# EAGLE schematic EE120PersonalProjectSchematic (EAGLE 7.3.0)
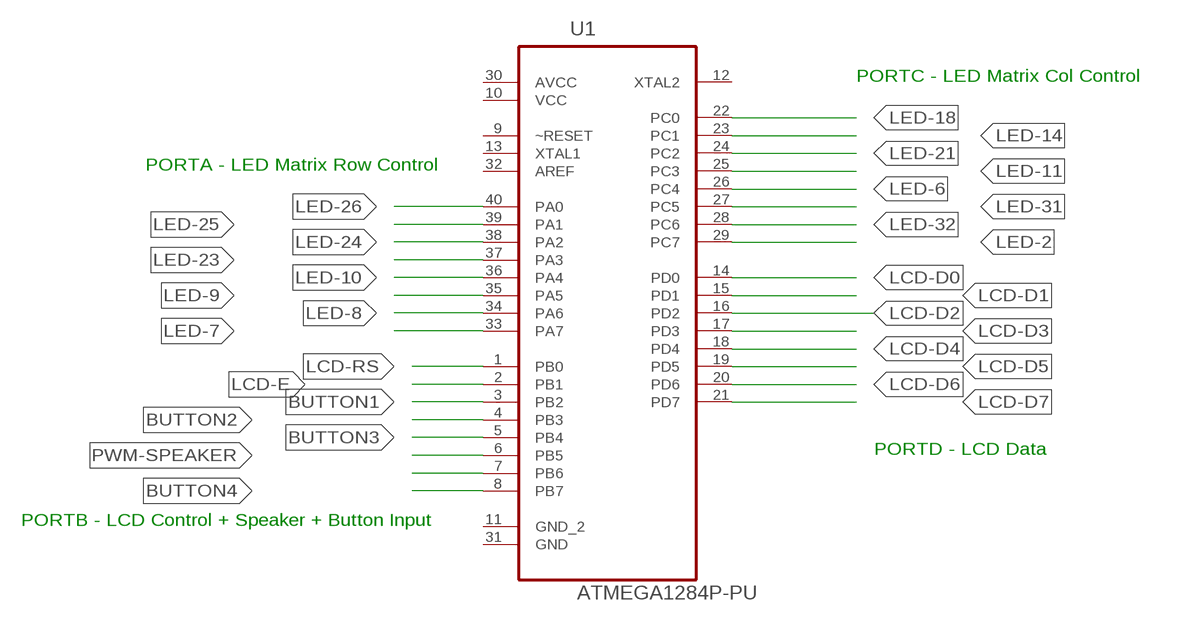
[diagram p0: schematic, sheet 1]

## Parts
U1  ATMEGA1284P-PU  [DIP254P1524X483-40]

## Nets
BUTTON1: U1.3(PB2)
BUTTON2: U1.4(PB3)
BUTTON3: U1.5(PB4)
BUTTON4: U1.8(PB7)
LCD-D0: U1.14(PD0)
LCD-D1: U1.15(PD1)
LCD-D2: U1.16(PD2)
LCD-D3: U1.17(PD3)
LCD-D4: U1.18(PD4)
LCD-D5: U1.19(PD5)
LCD-D6: U1.20(PD6)
LCD-D7: U1.21(PD7)
LCD-E: U1.2(PB1)
LCD-RS: U1.1(PB0)
LED-2: U1.29(PC7)
LED-6: U1.26(PC4)
LED-7: U1.33(PA7)
LED-8: U1.34(PA6)
LED-9: U1.35(PA5)
LED-10: U1.36(PA4)
LED-11: U1.25(PC3)
LED-14: U1.23(PC1)
LED-18: U1.22(PC0)
LED-21: U1.24(PC2)
LED-23: U1.37(PA3)
LED-24: U1.38(PA2)
LED-25: U1.39(PA1)
LED-26: U1.40(PA0)
LED-31: U1.27(PC5)
LED-32: U1.28(PC6)
N$9: U1.7(PB6)
PWM-SPEAKER: U1.6(PB5)
Unconnected: U1.9(~RESET) U1.11(GND_2) U1.12(XTAL2) U1.13(XTAL1) U1.31(GND) U1.32(AREF)

## Notes on the sheet
- PORTC - LED Matrix Col Control
- PORTA - LED Matrix Row Control
- PORTD - LCD Data
- PORTB - LCD Control + Speaker + Button Input

## Power pins joined to a net without a drawn wire
AVCC: U1.30(AVCC)
VCC: U1.10(VCC)

## Library data of the parts
U1 = atmel:ATMEGA1284P-PU: 8-bit Microcontroller with In-System Programmable Flash; MPN: ATMEGA1284P-PU; OC_FARNELL: 1715481; OC_NEWARK: 15R0264; PACKAGE: PDIP-40; SUPPLIER: Atmel